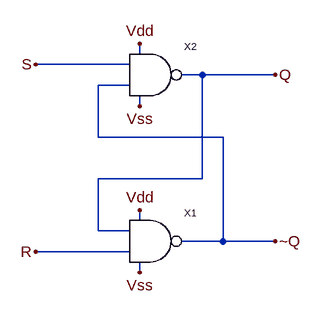
[diagram p0: schematic SR_NAND.asc]
SR_NAND.asc, the LTspice schematic file:
Version 4
SHEET 1 880 680
WIRE -176 -240 -176 -256
WIRE -192 -224 -336 -224
WIRE -80 -208 -112 -208
WIRE 32 -208 -80 -208
WIRE -192 -192 -240 -192
WIRE -176 -160 -176 -176
WIRE -240 -112 -240 -192
WIRE -48 -112 -240 -112
WIRE -80 -48 -80 -208
WIRE -80 -48 -240 -48
WIRE -176 16 -176 0
WIRE -240 32 -240 -48
WIRE -192 32 -240 32
WIRE -48 48 -48 -112
WIRE -48 48 -112 48
WIRE 32 48 -48 48
WIRE -192 64 -336 64
WIRE -176 96 -176 80
FLAG -176 -256 Vdd
FLAG -176 0 Vdd
FLAG -176 -160 Vss
FLAG -176 96 Vss
FLAG -336 -224 S
FLAG -336 64 R
FLAG 32 -208 Q
FLAG 32 48 ~Q
SYMBOL nand -192 80 R0
SYMATTR InstName X1
SYMBOL nand -192 -176 R0
SYMATTR InstName X2

The netlist it stands for:
* SR_NAND.asc
XX1 Q R ~Q Vdd Vss nand  ; pins A B Y Vdd Vss
XX2 S ~Q Q Vdd Vss nand  ; pins A B Y Vdd Vss
.backanno
.end